# Altium schematic sheet General.SchDoc
size A4; SheetNumber: 1; SheetTotal: 3
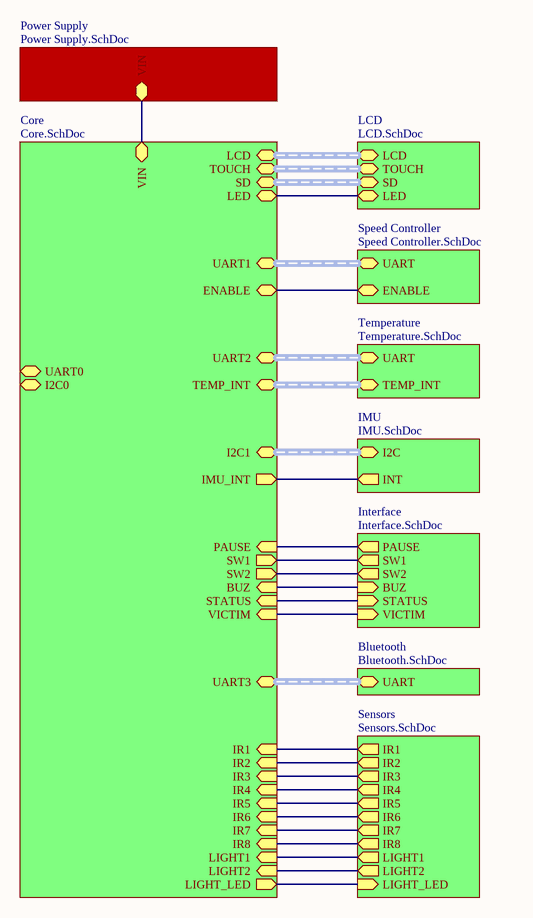
[diagram p0: General.SchDoc]

## Sub-sheets
Bluetooth = Bluetooth.SchDoc: UART (harness UART)
Core = Core.SchDoc: LCD (harness LCD_BUS), TOUCH (harness TOUCH_BUS), PAUSE (in), UART3 (harness UART), UART1 (harness UART), UART2 (harness UART), I2C0 (harness I2C), I2C1 (harness I2C), UART0 (harness UART), IR1 (in), IR2 (in), IR3 (in), IR4 (in), IR5 (in), IR6 (in), IR7 (in), IR8 (in), LIGHT1 (in), LIGHT2 (in), VICTIM (in), SW1 (out), SW2 (out), STATUS (in), ENABLE, TEMP_INT (harness TEMP_INT), VIN, LIGHT_LED (out), BUZ (in), LED, SD (harness SD), IMU_INT (out)
IMU = IMU.SchDoc: INT (out), I2C (harness I2C)
Interface = Interface.SchDoc: PAUSE (out), VICTIM (in), SW1 (out), SW2 (out), STATUS (in), BUZ (in)
LCD = LCD.SchDoc: LCD (harness LCD_BUS), TOUCH (harness TOUCH_BUS), LED, SD (harness SD)
Power Supply = Power Supply.SchDoc: VIN
Sensors = Sensors.SchDoc: IR1 (out), IR2 (out), IR3 (out), IR4 (out), IR5 (out), IR6 (out), IR7 (out), IR8 (out), LIGHT1 (out), LIGHT2 (out), LIGHT_LED (in)
Speed Controller = Speed Controller.SchDoc: UART (harness UART), ENABLE
Temperature = Temperature.SchDoc: UART (harness UART), TEMP_INT (harness TEMP_INT)

## Nets
(unnamed): sheet Core/PAUSE, sheet Interface/PAUSE
(unnamed): sheet Core/IR1, sheet Sensors/IR1
(unnamed): sheet Core/IR2, sheet Sensors/IR2
(unnamed): sheet Core/IR3, sheet Sensors/IR3
(unnamed): sheet Core/IR4, sheet Sensors/IR4
(unnamed): sheet Core/IR5, sheet Sensors/IR5
(unnamed): sheet Core/IR6, sheet Sensors/IR6
(unnamed): sheet Core/IR7, sheet Sensors/IR7
(unnamed): sheet Core/IR8, sheet Sensors/IR8
(unnamed): sheet Core/LIGHT1, sheet Sensors/LIGHT1
(unnamed): sheet Core/LIGHT2, sheet Sensors/LIGHT2
(unnamed): sheet Core/VICTIM, sheet Interface/VICTIM
(unnamed): sheet Core/SW1, sheet Interface/SW1
(unnamed): sheet Core/SW2, sheet Interface/SW2
(unnamed): sheet Core/STATUS, sheet Interface/STATUS
(unnamed): sheet Core/ENABLE, sheet Speed Controller/ENABLE
(unnamed): sheet Core/VIN, sheet Power Supply/VIN
(unnamed): sheet Core/LIGHT_LED, sheet Sensors/LIGHT_LED
(unnamed): sheet Core/BUZ, sheet Interface/BUZ
(unnamed): sheet Core/LED, sheet LCD/LED
(unnamed): sheet Core/IMU_INT, sheet IMU/INT

## Buses and harness runs
harness sheet Bluetooth/UART = sheet Core/UART3
harness sheet Core/I2C1 = sheet IMU/I2C
harness sheet Core/LCD = sheet LCD/LCD
harness sheet Core/SD = sheet LCD/SD
harness sheet Core/TEMP_INT = sheet Temperature/TEMP_INT
harness sheet Core/TOUCH = sheet LCD/TOUCH
harness sheet Core/UART1 = sheet Speed Controller/UART
harness sheet Core/UART2 = sheet Temperature/UART